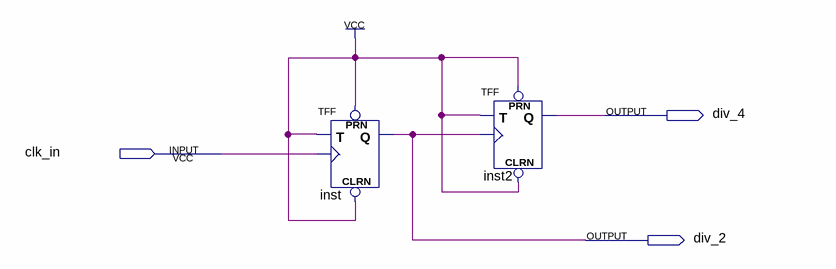
[diagram p0: schematic sheet]
// Quartus schematic clk_div_4.bdf as structural Verilog: 2 symbols, 3 pins
module clk_div_4 (
  input  clk_in,
  output div_4,
  output div_2
);

  TFF inst (.PRN(1'b1), .CLRN(1'b1), .T(1'b1), .CLK(clk_in), .Q(div_2));
  TFF inst2 (.PRN(1'b1), .CLRN(1'b1), .T(1'b1), .CLK(div_2), .Q(div_4));
endmodule
